# Altium schematic sheet Health_and_Status.SchDoc
size Tabloid
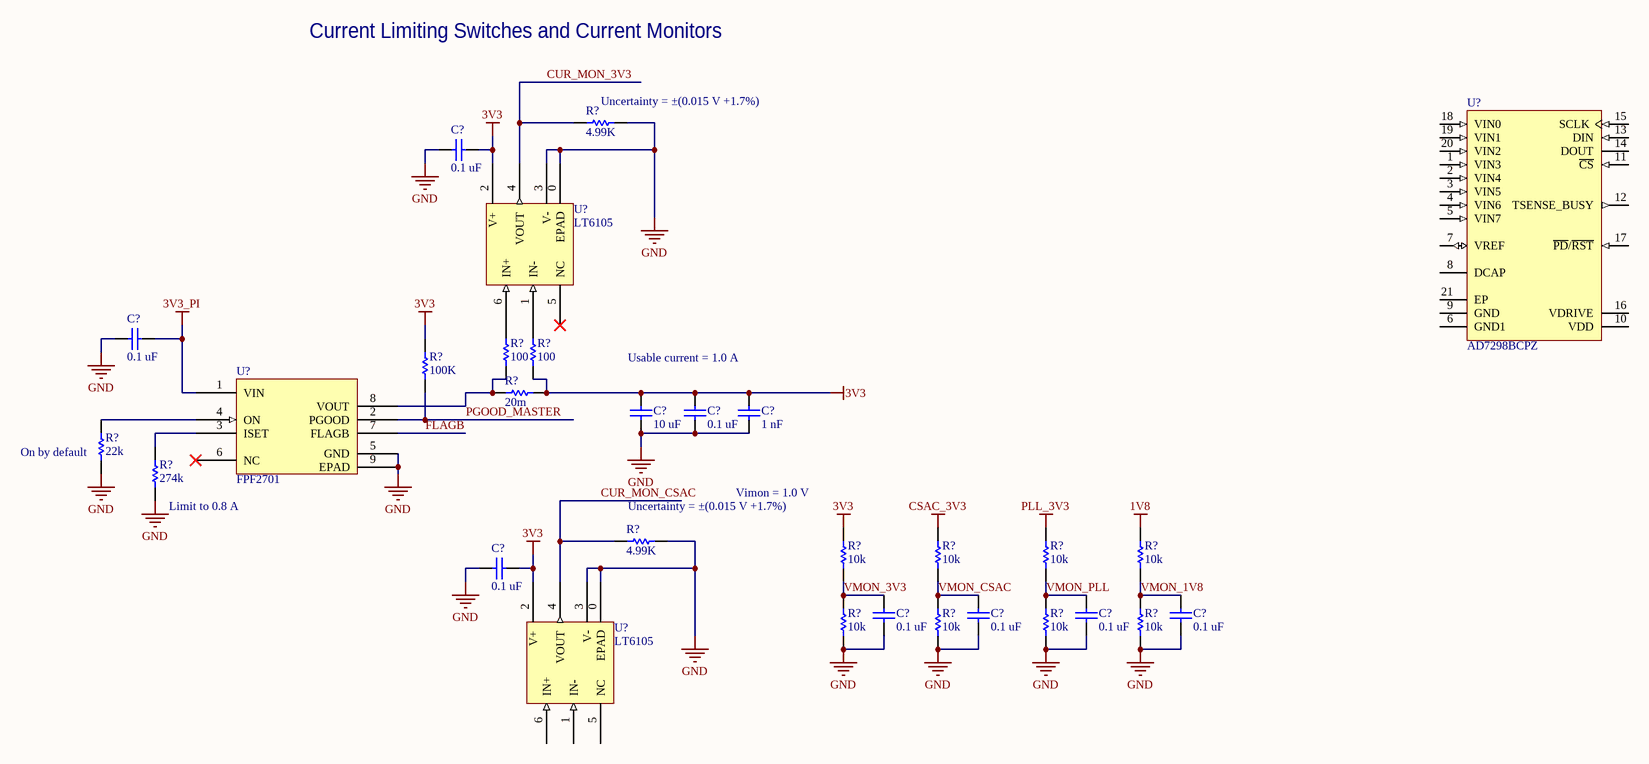
[diagram p0: Health_and_Status.SchDoc]

## Parts
(Parts that share a designator on the sheet are numbered #1, #2 ... from top to bottom, then left to right.)
C?#1  0.1 uF  [CAPC1005X55X25LL05T10]
C?#2  0.1 uF  [CAPC1005X55X25LL05T10]
C?#3  1 nF  [CAPC1005X55X30LL05T10]
C?#4  10 uF  [CAPC1608X90X20LL10]
C?#5  0.1 uF  [CAPC1005X55X25LL05T10]
C?#6  0.1 uF  [CAPC1005X55X25LL05T10]
C?#7  0.1 uF  [CAPC1005X55X25LL05T10]
C?#8  0.1 uF  [CAPC1005X55X25LL05T10]
C?#9  0.1 uF  [CAPC1005X55X25LL05T10]
C?#10  0.1 uF  [CAPC1005X55X25LL05T10]
R?#1  4.99K  [RESC1005X40X25LL05T05]
R?#2  100  [RESC0402(1005)_L]
R?#3  100  [RESC0402(1005)_L]
R?#4  100K  [RESC1005X40X25LL05T05]
R?#5  20m  [RESC1608X55X25LL10T15]
R?#6  22k  [RESC1005X40X25LL05T05]
R?#7  274k  [RESC1005X40X25NL05T05]
R?#8  4.99K  [RESC1005X40X25LL05T05]
R?#9  10k  [RESC1005X40X25LL05T05]
R?#10  10k  [RESC1005X40X25LL05T05]
R?#11  10k  [RESC1005X40X25LL05T05]
R?#12  10k  [RESC1005X40X25LL05T05]
R?#13  10k  [RESC1005X40X25LL05T05]
R?#14  10k  [RESC1005X40X25LL05T05]
R?#15  10k  [RESC1005X40X25LL05T05]
R?#16  10k  [RESC1005X40X25LL05T05]
U?#1  AD7298BCPZ  [CP-20-8_M]
U?#2  LT6105  [QFN50P300X200X80_HS-7N]
U?#3  FPF2701  [QFN65P300X300X80_HS-9N]
U?#4  LT6105  [QFN50P300X200X80_HS-7N]

## Nets
1V8: R?#12.2
3V3: C?#1.2 C?#3.2 C?#4.2 C?#5.2 C?#6.2 R?#3.1 R?#4.2 R?#5.2 R?#9.2 U?#2.2(V+) U?#4.2(V+)
3V3_PI: C?#2.2 U?#3.1(VIN)
CSAC_3V3: R?#10.2
GND: C?#1.1 C?#2.1 C?#3.1 C?#4.1 C?#5.1 C?#6.1 C?#7.1 C?#8.1 C?#9.1 C?#10.1 R?#1.2 R?#6.1 R?#7.1 R?#8.2 R?#13.1 R?#14.1 R?#15.1 R?#16.1 U?#2.0(EPAD) U?#2.3(V-) U?#3.5(GND) U?#3.9(EPAD) U?#4.0(EPAD) U?#4.3(V-)
PLL_3V3: R?#11.2
CUR_MON_3V3: R?#1.1 U?#2.4(VOUT)
CUR_MON_CSAC: R?#8.1 U?#4.4(VOUT)
FLAGB: U?#3.7(FLAGB)
PGOOD_MASTER: R?#4.1 U?#3.2(PGOOD)
VMON_1V8: C?#10.2 R?#12.1 R?#16.2
VMON_3V3: C?#7.2 R?#9.1 R?#13.2
VMON_CSAC: C?#8.2 R?#10.1 R?#14.2
VMON_PLL: C?#9.2 R?#11.1 R?#15.2
NetR?#2_1: R?#2.1 R?#5.1 U?#3.8(VOUT)
NetR?#2_2: R?#2.2 U?#2.6(IN+)
NetR?#3_2: R?#3.2 U?#2.1(IN-)
NetR?#6_2: R?#6.2 U?#3.4(ON)
NetR?#7_2: R?#7.2 U?#3.3(ISET)

Not connected (* = marked no-connect by the designer): U?#1 1(VIN3) 2(VIN4) 3(VIN5) 4(VIN6) 5(VIN7) 6(GND1) 7(VREF) 8(DCAP) 9(GND) 10(VDD) 11(~{CS}) 12(TSENSE_BUSY) 13(DIN) 14(DOUT) 15(SCLK) 16(VDRIVE) 17(~{PD}/~{RST}) 18(VIN0) 19(VIN1) 20(VIN2) 21(EP); U?#2 5(NC)*; U?#3 6(NC)*; U?#4 1(IN-) 5(NC) 6(IN+)

## Notes on the sheet
- Current Limiting Switches and Current Monitors
- (near R?#1) Uncertainty = ±(0.015 V +1.7%)
- (near C?#4) Usable current = 1.0 A
- (near R?#6) On by default
- Vimon = 1.0 V
- (near R?#7) Limit to 0.8 A
- (near R?#8) Uncertainty = ±(0.015 V +1.7%)
- Title
- Size
- Date
- Tabloid
- DCN
- Time
- Sheet
- of
- Revision
- Drawn
- 33-207 / 77 Mass. Ave.
- Cambridge, MA 02139
- File

## Library data of the parts
C?#1 C?#2 C?#5-C?#10 = CMP-2100-03641-1: Chip Capacitor, 0.1 uF, +/- 10%, 16 V, -55 to 125 degC, 0402 (1005 Metric), RoHS, Tape and Reel; Manufacturer: Murata; Material: Ceramic; Insulation Resistance: 10GR; Voltage: 16V; Dielectric: X7R; Capacitance: 100nF; REACH SVHC: NoSVHC; Depth: 0.5mm; Case/Package: 0402; Datasheet URL: http://psearch.en.murata.com/capacitor/product/GRM155R71C104KA88%23.pdf; Lead Free: LeadFree; Dielectric Material: Ceramic; Manufacturer URL: http://www.murata.com/; Min Operating Temperature: -55degC; Length: 1mm; Case Code (Metric): 1005; Radiation Hardening: No; Package Reference: 0402; RoHSCompliant: true; Datasheet Version: 42675.0; Thickness: 0.022inch; Packaging: TapeandReel; Voltage Rating (DC): 16V; Tolerance: 10%; Max Operating Temperature: 125degC; Package Description: 2-Pin Surface Mount Device, Body 1 x 0.5 mm; Mount: SurfaceMount; Height: 0.5mm; Width: 0.5mm; Number of Pins: 2; Voltage Rating: 16V; Case Code (Imperial): 0402; Termination: SMD/SMT; Package Quantity: 1
C?#3 = CMP-2008-03058-1: Part Number: C0402C102K4RACTU; Manufacturer: Kemet
C?#4 = CMP-2000-04979-1: Chip Capacitor, 10 uF, +/- 10%, 10 V, -55 to 85 degC, 0603 (1608 Metric), RoHS, Tape and Reel; PCN Part Number: MLCCPartNumberChange30/Nov/2012; Manufacturer: TDK; Temperature Coefficient: X5R; Product Training Modules: CSeriesGeneralApplicationsSEAT,CCV,andTVCLDesignToolsGuidetoReplacinganElectrolyticCapacitorwithanMLCC; Online Catalog: CSeries,GeneralPurpose; Voltage - Rated: 10V; Other Names: 445-7486-1; Capacitance: 10µF; Design Resources: 20WNon-IsolatedBuckLEDDriverUsingPLLNK460KG; Kits: 445-9003-KIT-ND-KITCAPCERHICAPMLCCSMD; Height - Seated (Max): -; Family: CeramicCapacitors; Package Description: 2-Pin Surface Mount Device, Body 1.6 x 0.8 mm; Category: Capacitors; Datasheet Version: Mar-15; RoHS Information: RoHSCertificate-MLCC; Thickness (Max): 0.035"(0.90mm); Operating Temperature: -55degC~85degC; Package Reference: 603; Series: C; Applications: GeneralPurpose; Datasheet URL: http://download.siliconexpert.com/pdfs/2015/4/21/15/54/45/779/tdk_/manual/37024850441143360mlcc_commercial_general_en.pdf; Features: -; Lead Style: -; Lead Spacing: -; Ratings: -; Size / Dimension: 0.063"Lx0.031"W(1.60mmx0.80mm); Tolerance: ±10%; Mounting Type: SurfaceMount,MLCC; Standard Package: 1; Package / Case: 0603(1608Metric); Manufacturer URL: http://www.tdk.com/; Packaging: CutTape(CT)
R?#1 R?#8 = CMP-2002-00966-3: Chip Resistor, 4.99 KOhm, +/- 1%, 100 mW, -55 to 155 degC, 0402 (1005 Metric), RoHS, Tape and Reel; Manufacturer: Basic Passives; PartNumber: ERJ-2RKF4991X; Power Rating: 100 mW; Case\/Package: 0402; Voltage Rating: 50 V; REACH SVHC: Unknown; PackageDescription: 2-Pin Surface Mount Device, Body 1 x 0.5 mm; Mounting Technology: Surface Mount; ComponentLink2URL: http://industrial.panasonic.com/cdbs/www-data/pdf/RDA0000/AOA0000C86.pdf; Packaging: Tape and Reel; Case Code (Imperial): 0402; PackageReference: 0402; Min Operating Temperature: -55 degC; ComponentLink1URL: http://www.panasonic.com/; Width: 0.5 mm; Mount: Surface Mount; Max Operating Temperature: 155 degC; Radiation Hardening: No; Resistance: 4.99 KOhm; ComponentLink1Description: Manufacturer URL; Case Code (Metric): 1005; Pins: 2; Package Quantity: 10000; DatasheetVersion: 04/2015; ComponentLink2Description: Datasheet; Weight: 2.8E-05oz; Length: 1 mm; Tolerance: 1%; RoHSCompliant: true; Height: 0.35 mm
R?#2 R?#3 = CMP-1011-00397-1: 100R 0.063W 1% 0402 (1005 Metric)  SMD; Case-EIA: 0402; Case-Metric: 1005; Value: 100.00 Ohm; Technology: SMT; Tolerance: 1 %; Power: 0.063 W
R?#4 = CMP-2002-08123-2: Chip Resistor, 100 KOhm, +/- 1%, 0.63 W, -55 to 155 degC, 0402 (1005 Metric), RoHS, Tape and Reel; Voltage Rating: 50 V; Type (Resistor): Thick Film; Power Rating: 63 mW; Case\Package: 0402; Mount: Surface Mount; Packaging: Tape and Reel; Weight: 2.3E-05 oz; PackageDescription: 2-Pin Surface Mount Device, Body 1 x 0.5 mm; ComponentLink1Description: Manufacturer URL; ComponentLink2Description: Datasheet; Min Operating Temperature: -55 degC; Width: 0.5 mm; Resistance: 100 kohm; REACH SVHC: Unknown; ComponentLink2URL: http://www.vishay.com/docs/20035/dcrcwe3.pdf; Package Quantity: 10000; Mounting Technology: Surface Mount; PackageReference: 0402; ComponentLink1URL: http://www.vishay.com/; Max Operating Temperature: 155 degC; Length: 1 mm; DatasheetVersion: 06/2012; Height: 0.35 mm; Case Code (Imperial): 0402; Pins: 2; Tolerance: 1%; Case Code (Metric): 1005; Radiation Hardening: No; RoHSCompliant: true
R?#5 = CMP-2000-04331-1: Manufacturer: Yageo; Part Number: RL0603FR-070R02L
R?#6 = CMP-2002-01133-1: Part Number: ERJ2RKF2202X; Manufacturer: Panasonic
R?#7 = CMP-2002-08429-1: Part Number: CRCW0402274KFKED; Manufacturer: Vishay Dale
R?#9-R?#16 = CMP-2002-08135-1: Manufacturer: Vishay Dale; Part Number: CRCW040210K0FKED
U?#1 = CMP-0313-00349-2: 8 Channel 12-Bit SAR Analog-to-Digital Converter with SPI Interface and Temperature Sensor 1MSPS, -40 to +125 degC, CP-20-8, Pb-Free, Tray; Manufacturer: Analog Devices; Generic Part Number: AD7298; Resolution (Bits): 12; Throughput Rate (SPS): 1M; Channels: 9; ComponentLink3URL: http://www.analog.com/static/imported-files/packages/PKG_PDF/LFCSP(CP)/CP-20/CP_20_8.pdf; PackageDescription: 20-Lead Lead Frame Chip Scale Package [LFCSP_WQ] 4 x 4 mm Body, Very Very Thin Quad; ComponentLink2URL: http://www.analog.com/static/imported-files/data_sheets/AD7298.pdf; Packing: Tray; PartNumber: AD7298BCPZ; ComponentLink4URL: http://www.analog.com/en/analog-to-digital-converters/ad-converters/ad7298/products/product.html; RoHS: Y; PackageReference: CP-20-8; PackageVersion: 020509-B; Mounting Technology: Surface Mount; ComponentLink3Description: Package Specification; DatasheetVersion: Rev.B; Code_JEDEC: MO-220-WGGD; ComponentLink2Description: Datasheet; ComponentLink4Description: Product URL; ComponentLink1Description: Manufacturer URL; ComponentLink1URL: http://www.analog.com/en/index.html; Interface: SPI
U?#3 = FPF2701: Manufacturer 1: ON Semiconductor / Fairchild; Manufacturer Part Number 1: FPF2701MPX; Max Power Dissipation: 1.25W; Number of Inputs: 1; Output Current: 2A; On-State Resistance: 88mR; Interface: On/Off; Max Input Voltage: 36V; Min Input Voltage: 2.8V; Fault Protection: Over Temperature; Output Configuration: High Side; ComponentLink1Description: Datasheet; ComponentLink1URL: https://www.onsemi.com/pub/Collateral/FPF2702-D.pdf; Supplier 1: Avnet; Stock 1: 3000; Pricing 1: 3000=2.19054, 6000=1.20150, 12000=1.19260, 18000=1.18370, 24000=1.17480 (USD); RoHS: Yes; Mount: Surface Mount; Number of Pins: 8; Weight: 0.151g; Min Operating Temperature: -40°C; Max Operating Temperature: 85°C; Packaging: Tape and Reel; Package Quantity: 3000; Number of Outputs: 1; Max Output Current: 2A; Operating Supply Voltage: 36V; Length: 3mm; Height: 0.75mm; Width: 3mm; Radiation Hardening: No; REACH SVHC: No SVHC; Lead Free: Lead Free; ComponentLink2URL: https://datasheet.ciiva.com/4923/fpf2701-191159-4923264.pdf?src-supplier=Mouser; ComponentLink2Description: https://datasheet.ciiva.com/4923/fpf2701-191159-4923264.pdf?src-supplier=Mouser; ComponentLink3URL: https://datasheet.ciiva.com/15113/getdatasheetpartid-571901-15113998.pdf?src-supplier=Verical; ComponentLink3Description: https://datasheet.ciiva.com/15113/getdatasheetpartid-571901-15113998.pdf?src-supplier=Verical; ComponentLink4URL: https://datasheet.ciiva.com/15062/fpf2701-15062917.pdf?src-supplier=Digi-Key; ComponentLink4Description: https://datasheet.ciiva.com/15062/fpf2701-15062917.pdf?src-supplier=Digi-Key; ComponentLink5URL: https://datasheet.ciiva.com/1512/1785288-1512486.pdf?src-supplier=Element14; ComponentLink5Description: https://datasheet.ciiva.com/1512/1785288-1512486.pdf?src-supplier=Element14; ComponentLink6URL: https://datasheet.ciiva.com/3216/fpf2702-3216922.pdf?src-supplier=Avnet; ComponentLink6Description: https://datasheet.ciiva.com/3216/fpf2702-3216922.pdf?src-supplier=Avnet; ComponentLink7URL: https://datasheet.ciiva.com/25902/fpf2702-25902287.pdf?src-supplier=Avnet+Europe; ComponentLink7Description: https://datasheet.ciiva.com/25902/fpf2702-25902287.pdf?src-supplier=Avnet+Europe; ComponentLink8URL: https://datasheet.ciiva.com/48696/001252661-da-01-en-ic-load-switch-0-4-fpf2701mpx-mlp-8-fsc-48696074.pdf?src-supplier=Conrad; ComponentLink8Description: https://datasheet.ciiva.com/48696/001252661-da-01-en-ic-load-switch-0-4-fpf2701mpx-mlp-8-fsc-48696074.pdf?src-supplier=Conrad
U?#2 U?#4 = LT6105: ComponentLink1Description: Datasheet; ComponentLink1URL: https://www.analog.com/media/en/technical-documentation/data-sheets/6105fa.pdf